# EAGLE design GBP USB-C Charging Kit (EAGLE 6.2)
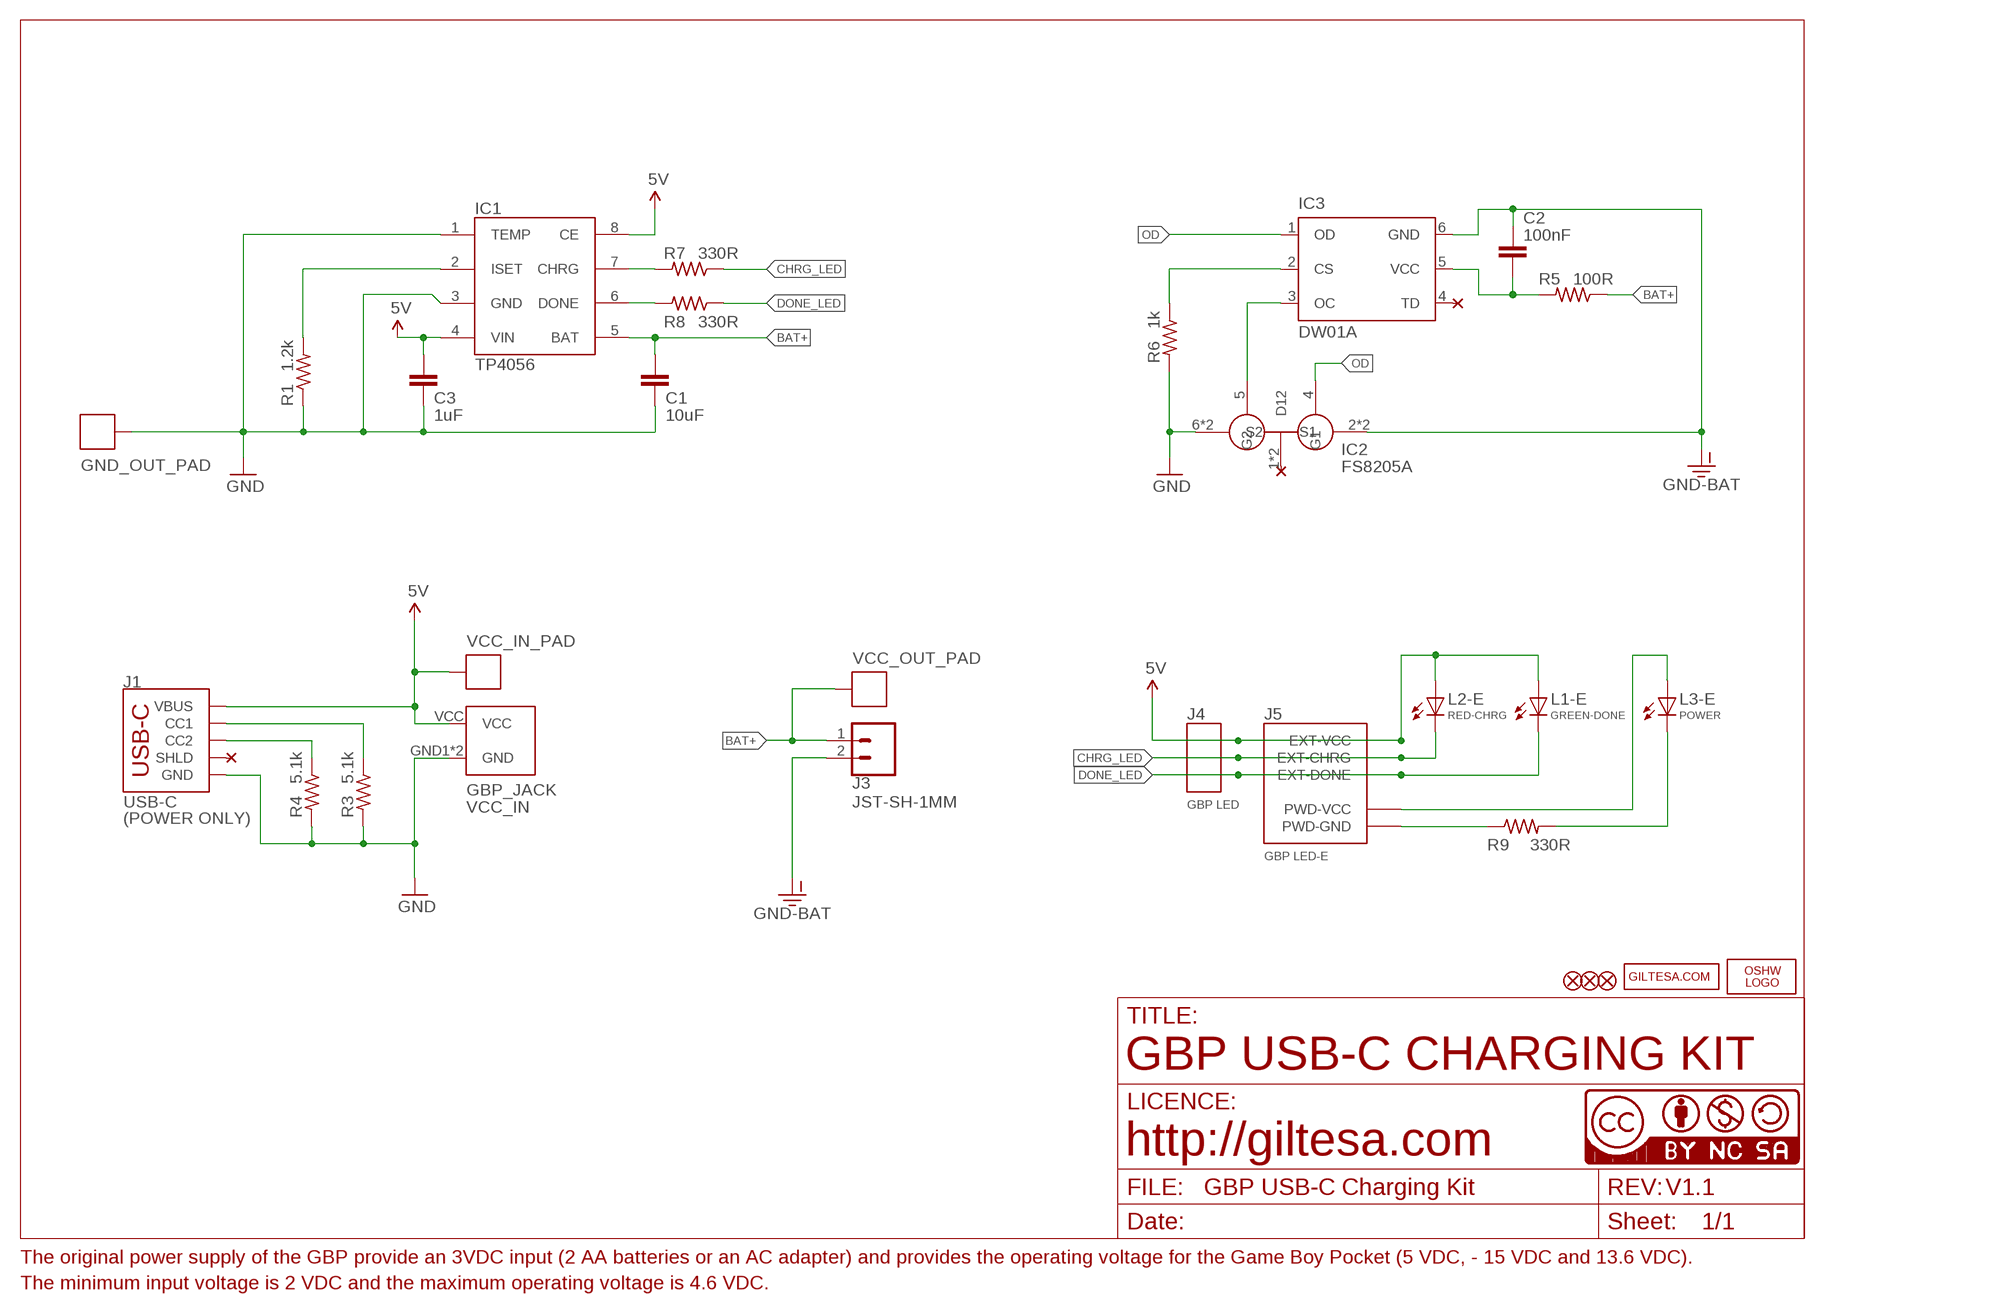
[diagram p0: schematic, sheet 1]

## Parts
C1  10uF  C0805  [C0805]
C2  100nF  C0603  [C0603]
C3  1uF  C0603  [C0603]
FD2  FIDUCIALUFIDUCIAL  [FIDUCIAL-MICRO]
FD3  FIDUCIALUFIDUCIAL  [FIDUCIAL-MICRO]
FD4  FIDUCIALUFIDUCIAL  [FIDUCIAL-MICRO]
GBP_JACK  VCC_IN  GBP_POWER_JACK  [GBP_POWER_JACK]
GND_OUT_PAD  1X01_SMT_1.8MM_2  [1X01_SMT_1.8MM_2]
IC1  TP4056  DIO5158  [SOIC-8]
IC2  8205A  FS8205A  [TSSOP8]
IC3  DW01A  DW01-P  [SOT23-6L]
J1  USB-C  USB-CPOWER  [USB-C_6P]
J3  JST-SH-1MM  JST-21MM  [JST-2-1MM-SMD_RIGHT]
J4  GBP LED  1X032  [1X03_SMD_2]
J5  GBP LED-E  GBP_LED  [GBP_LED]
L1-E  GREEN-DONE  L0402  [L0402]
L2-E  RED-CHRG  L0402  [L0402]
L3-E  POWER  L0402  [L0402]
LOGO1  OSHW_LOGO_FILLX0150-NT  [OSHW_FILLX150_NOTEXT]
R1  1.2k  R0402  [R0402]
R3  5.1k  R0402  [R0402]
R4  5.1k  R0402  [R0402]
R5  100R  R0402  [R0402]
R6  1k  R0402  [R0402]
R7  330R  R0402  [R0402]
R8  330R  R0402  [R0402]
R9  330R  R0402  [R0402]
U$6  CC-BY-NC-SA15MM  [CC-BY-NC-SA_15MM]
U$16  GILTESA.COM_MASK  [GILTESA.COM_MASK]
U$17  CC-NC-BCNIX  [CC-NC-B_NIX]
VCC_IN_PAD  1X01_SMT_1.8MM_3  [1X01_SMT_1.8MM_3]
VCC_OUT_PAD  1X01_SMT_1.8MM_3  [1X01_SMT_1.8MM_3]

## Nets
5V: C3.1 GBP_JACK.VCC IC1.4(VIN) IC1.8(CE) J1.VBUS1(VBUS) J1.VBUS2(VBUS) J4.3 J5.EXT-VCC L1-E.A L2-E.A VCC_IN_PAD.P$1
BAT+: C1.1 IC1.5(BAT) J3.1 R5.1 VCC_OUT_PAD.P$1
CHRG: IC1.7(CHRG) R7.2
CHRG_LED: J4.2 J5.EXT-CHRG L2-E.C R7.1
DONE: IC1.6(DONE) R8.2
DONE_LED: J4.1 J5.EXT-DONE L1-E.C R8.1
GND: C1.2 C3.2 GBP_JACK.GND1(GND) GBP_JACK.GND2(GND) GND_OUT_PAD.P$1 IC1.1(TEMP) IC1.3(GND) IC2.6(S2) IC2.7(S2) J1.GND1(GND) J1.GND2(GND) R1.1 R3.2 R4.2 R6.2
GND-BAT: C2.1 IC2.2(S1) IC2.3(S1) IC3.6(GND) J3.2
ISET: IC1.2(ISET) R1.2
N$1: IC3.2(CS) R6.1
N$2: IC2.5(G2) IC3.3(OC)
N$4: J1.A5(CC1) R3.1
N$6: J1.B5(CC2) R4.1
N$11: L3-E.C R9.2
OD: IC2.4(G1) IC3.1(OD)
PWD-GND: J5.PWD-GND J5.PWD-GND'(PWD-GND) R9.1
PWD-VCC: J5.PWD-VCC J5.PWD-VCC'(PWD-VCC) L3-E.A
VCC-DW: C2.2 IC3.5(VCC) R5.2
Unconnected: IC2.1(D12) IC2.8(D12) IC3.4(TD) J1.SHLD1(SHLD) J1.SHLD2(SHLD) J1.SHLD3(SHLD) J1.SHLD4(SHLD) J1.SHLD5(SHLD) J1.SHLD6(SHLD) J1.SHLD7(SHLD) J1.SHLD8(SHLD)

## Notes on the sheet
- IC2
- FS8205A
- (POWER ONLY)
- GBP USB-C CHARGING KIT
- http://giltesa.com
- V1.1
- The original power supply of the GBP provide an 3VDC input (2 AA batteries or an AC adapter) and provides the operating voltage for the Game Boy Pocket (5 VDC, - 15 VDC and 13.6 VDC).
- The minimum input voltage is 2 VDC and the maximum operating voltage is 4.6 VDC.

## Library data of the parts
C1 = ,giltesa:C0805
C2 C3 = ,giltesa:C0603
FD2-FD4 = SparkFun-Aesthetics:FIDUCIAL: Fiducial Alignment Points Point-of-reference for pick-and-place machines and other optical instruments.
GBP_JACK = ,giltesa:GBP_POWER_JACK
GND_OUT_PAD VCC_IN_PAD VCC_OUT_PAD = ,giltesa:1X01
IC1 = ERADIONICA:DIO5158
IC2 = SparkFun:FS8205A
IC3 = lipo:DW01-P: One Cell Lithium-ion/Polymer Battery Protection IC The DW01-P battery protection IC is designed to protect lithium-ion/polymer battery from damage or degrading the lifetime due to overcharge, overdischarge, and/or overcurrent for one-cell lithium-ion/polymer battery powered systems, such as cellular phones. The ultra-small package and less required external components make it ideal to integrate the DW01-P into the limited space of battery pack. The accurate ±50mV overcharging detection voltage ensures safe and full utilization charging. The very low standby current drains little current from the cell while in storage.
J1 = ,giltesa:USB-C
J3 = ,giltesa:JST-2
J4 = ,giltesa:1X03
J5 = ,giltesa:GBP_LED
L1-E L2-E L3-E = ,giltesa:L0402
LOGO1 = ohw-logo:OSHW_LOGO_FILL
R1 R3-R9 = ,giltesa:R0402
U$6 = ,giltesa_logos:CC-BY-NC-SA
U$16 = ,giltesa_logos:GILTESA.COM
U$17 = cc-by-nc-sa:CC-NC-BC: All hardware is licensed under the Creative Commons Attribution-Noncommercial-Share Alike 2.5 Switzerland License. To view a copy of this license, visit http://creativecommons.org/licenses/by-nc-sa/2.5/ch/ or send a letter to Creative Commons, 171 Second Street, Suite 300, San Francisco, California, 94105, USA.

## Net classes
1 power: width 0.61 mm, drill 0.406 mm, clearance 0.203 mm
2 gnd: width 0.305 mm, drill 0.406 mm, clearance 0.203 mm
3 power usb: width 0.508 mm, drill 0.406 mm, clearance 0.203 mm

## Board
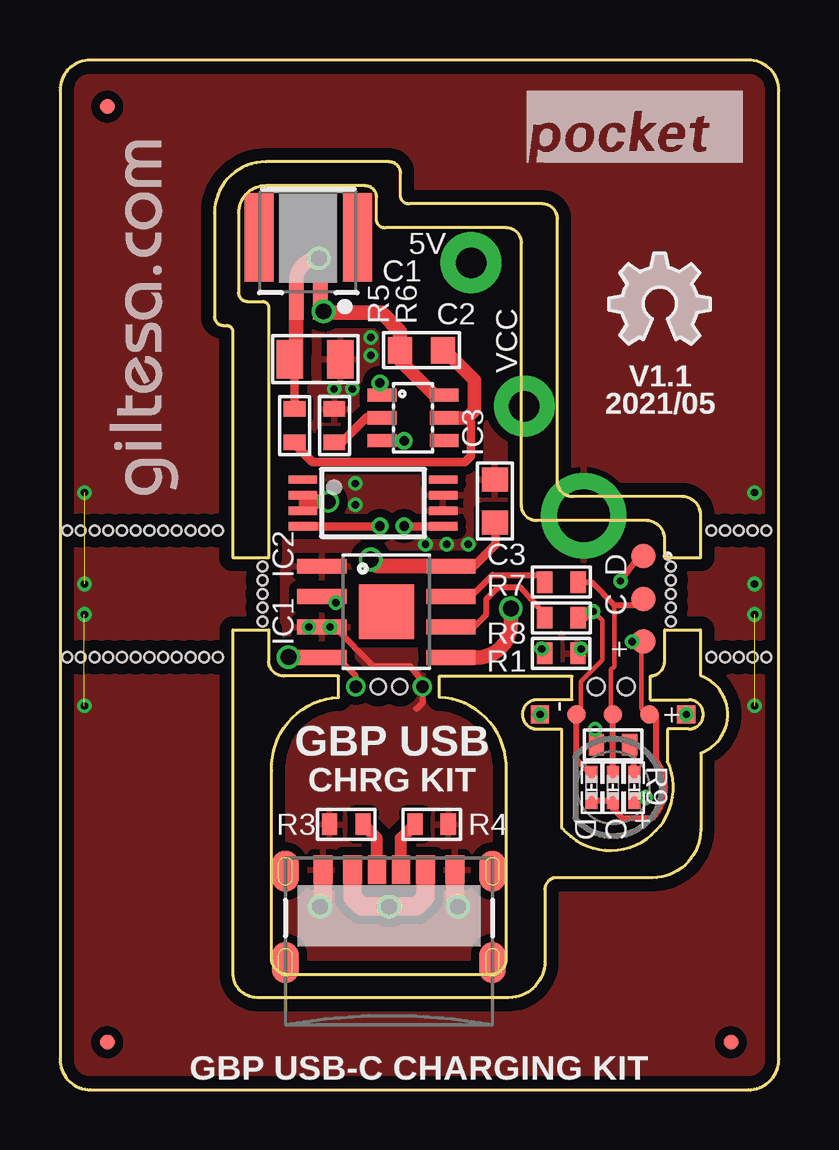
[diagram p1: board, top side]
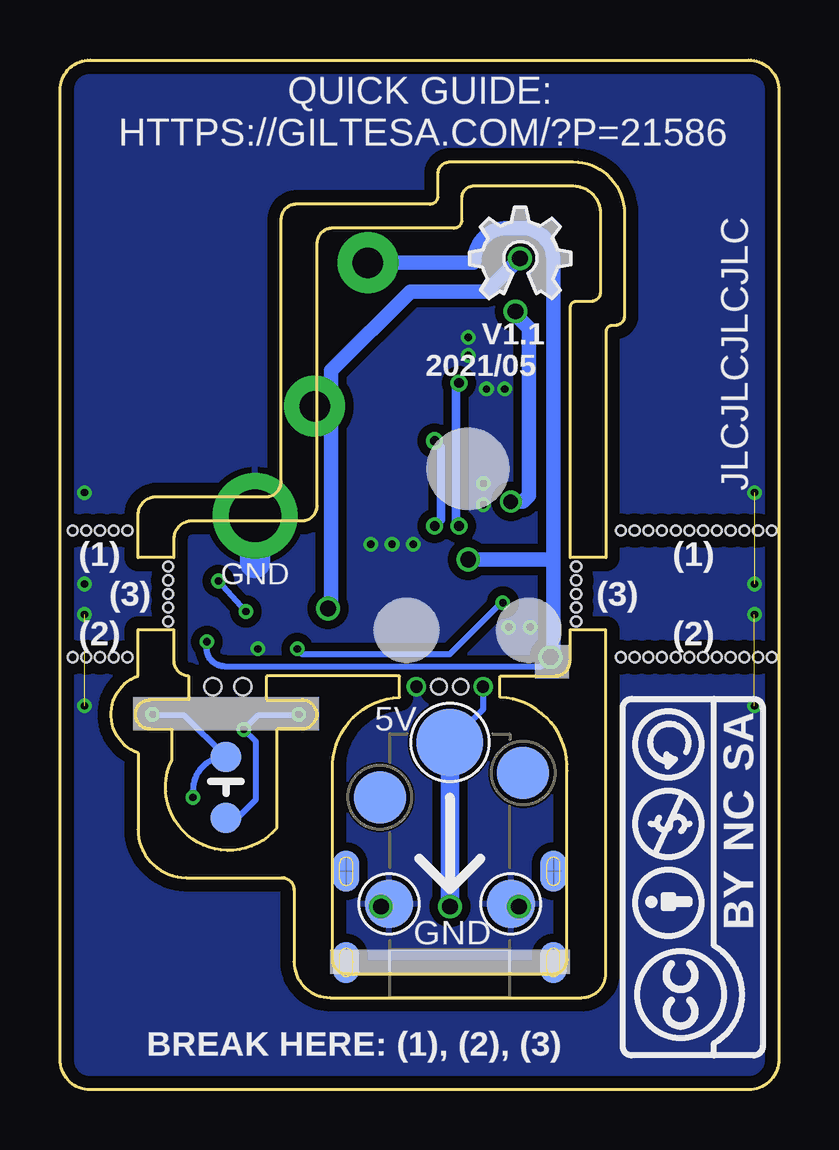
[diagram p2: board, bottom side, seen from below]

Size 29.97 x 42.93 mm. Coordinates in mm from the lower left corner, seen from the top.
Outline: 24.6,17.25 24.6,16.26 26.21,16.26 arc-180 26.21,15.04 25.32,15.04 25.32,13.71 arc-165 20.92,10.92 20.92,15.04 19.89,15.04 arc-180 19.89,16.26 21.35,16.26 21.35,17.25 15.81,17.25 15.81,16.36 arc-90 18.61,13.31 18.61,5.45 arc-90 17.97,4.82 9.46,4.82 arc-90 8.83,5.45 8.83,13.31 arc-90 11.62,16.36 11.62,17.25 9.34,17.25 arc-90 8.7,17.88 8.7,19.17 7.22,19.17 7.22,4.84 arc90 8.22,3.84 18.72,3.84 arc90 20.22,5.34 20.22,8.34 arc-90 20.72,8.84 24.72,8.84 arc90 26.72,10.84 26.72,14.04 arc140 26.72,17.26 26.71,19.17 25.21,19.17 25.21,17.88 arc-90 24.6,17.25
Outline: 25.21,22.18 25.21,22.96 arc90 24.45,23.72 19.88,23.72 arc-90 19.24,24.36 19.24,35.29 arc90 18.61,35.93 13.59,35.93 arc-90 13.21,36.21 13.21,37.21 arc90 12.7,37.68 8.57,37.68 arc90 7.44,36.54 7.44,33.24 arc90 7.82,32.86 8.45,32.86 arc-90 8.7,32.61 8.7,22.18 7.2,22.18 7.2,31.61 arc90 6.95,31.86 6.82,31.86 arc-90 6.44,32.24 6.44,36.54 arc-90 8.57,38.68 13.7,38.68 arc-90 14.21,38.21 14.21,37.21 arc90 14.59,36.93 20.11,36.93 arc-90 20.74,36.29 20.74,25.36 arc90 21.38,24.72 25.95,24.72 arc-90 26.71,23.96 26.71,22.18 25.21,22.18
Outline: 1.27,0 28.7,0 arc90 29.97,1.27 29.97,41.66 arc90 28.7,42.93 1.27,42.93 arc90 0,41.66 0,1.27 arc90 1.27,0
Copper layers (1*16): Top 0.035mm / dielectric 1.6mm / Bottom 0.035mm
Design rules: minimum track width 6mil, minimum drill 12mil, track to track 6mil, track to pad 6mil, pad to pad 6mil, via to via 8mil, smd to smd 0mil, copper to edge 20mil, drill to drill 10mil, minimum pad ring 6mil, minimum via ring 6mil, stop-mask expansion 0mil, vias tented up to drill 100mil, thermal gap 10mil
Holes 0.64 mm at 13.27,16.8 14.17,16.8
Holes 0.71 mm at 22.35,16.8 23.6,16.8
Holes 0.41 mm at 25.47,21.24 25.47,20.1 25.47,20.67 8.45,21.24 8.45,20.1 8.45,20.67 27.16,23.31 28.3,23.31 27.73,23.31 28.87,23.31 29.45,23.31 27.16,18.03 28.3,18.03 27.73,18.03 28.87,18.03 29.45,18.03 4.3,23.31 5.44,23.31 4.87,23.31 6.01,23.31 6.59,23.31 4.3,18.03 5.44,18.03 4.87,18.03 6.01,18.03 6.59,18.03 3.73,18.03 3.16,18.03 2.59,18.03 2.01,18.03 1.44,18.03 0.87,18.03 0.3,18.03 3.73,23.31 3.16,23.31 2.59,23.31 2.01,23.31 1.44,23.31 0.87,23.31 0.3,23.31 8.45,21.81 8.45,19.53 25.47,21.81 25.47,19.53
tRestrict: area 8.4,19.2 to 8.8,22.1
bRestrict: area 25,19.2 to 25.4,22.1

### Footprints (pad centres in the part's own frame; a part is rotated, then mirrored left to right if it is on the bottom)
C0805 = smd 1.1 x 1.6: 1 -1.05,0; 2 1.05,0
C0603 = smd 1 x 1.1: 1 -0.901,0; 2 0.901,0
FIDUCIAL-MICRO = smd 0.635 x 0.635: 1 0,0
GBP_POWER_JACK = smd 2.032 x 2.032 bottom: GND1 -2.54,1.905; GND2 2.54,1.905 | smd 2.2 x 2.2 bottom: NC1 -3.048,7.366; NC2 2.921,6.35 | smd 2.8 x 2.8 bottom: VCC 0,8.636
1X01_SMT_1.8MM_2 = drill 2.184 pad 3.556: P$1 0,0
SOIC-8 = smd 0.61 x 2.057: 1 -2.07,-2.892; 2 -0.8,-2.892; 3 0.47,-2.892; 4 1.74,-2.892; 5 1.74,2.492; 6 0.47,2.492; 7 -0.8,2.492; 8 -2.07,2.492 | smd 2.286 x 2.286: EPAD -0.165,-0.2
TSSOP8 = smd 1.2 x 0.35: 1 -2.925,0.975; 2 -2.925,0.325; 3 -2.925,-0.325; 4 -2.925,-0.975; 5 2.925,-0.975; 6 2.925,-0.325; 7 2.925,0.325; 8 2.925,0.975
SOT23-6L = smd 0.55 x 1.2: 1 -0.95,-1.3; 2 0,-1.3; 3 0.95,-1.3; 4 0.95,1.3; 5 0,1.3; 6 -0.95,1.3
USB-C_6P = smd 0.76 x 1.2: A5 -0.5,-0.08; B5 0.5,-0.08 | smd 0.8 x 1.2: GND1 -2.75,-0.08; GND2 2.75,-0.08; VBUS1 -1.52,-0.08; VBUS2 1.52,-0.08 | smd 1.1 x 1.7: SHLD1 -4.32,-0.15; SHLD2 4.32,-0.15; SHLD5 -4.32,-3.95; SHLD8 4.32,-3.95 | smd 1.1 x 1.7 bottom: SHLD3 -4.32,-0.15; SHLD4 4.32,-0.15; SHLD6 -4.32,-3.95; SHLD7 4.32,-3.95
JST-2-1MM-SMD_RIGHT = smd 0.6 x 1.524: 1 -0.5,-2.017; 2 0.5,-2.017 | smd 1.219 x 3.683: NC1 -2.054,0.635; NC2 2.054,0.635
1X03_SMD_2 = smd 1.016 x 1.016: 1 0,-1.778; 2 0,0; 3 0,1.778
GBP_LED = smd 0.762 x 0.762: EXT-CHRG -3.048,0; EXT-DONE -3.048,-1.524; EXT-VCC -3.048,1.524; PWD-GND' -3.048,-3.048; PWD-VCC' -3.048,3.048 | smd 1.27 x 1.27 bottom: PWD-GND 1.27,0; PWD-VCC -1.27,0
L0402 = smd 0.7 x 0.5: A -0.55,0; C 0.55,0
R0402 = smd 0.635 x 0.9: 1 -0.694,0; 2 0.694,0
1X01_SMT_1.8MM_3 = drill 1.27 pad 2.54: P$1 0,0

### Placement (x,y rotation side)
C1  10.64,30.45 0 top
C2  15.07,30.82 0 top
C3  18.13,24.54 90 top
FD2  27.97,1.99 0 top
FD3  1.97,1.99 0 top
FD4  1.97,40.99 0 top
GBP_JACK  13.72,5.84 0 top
GND_OUT_PAD  21.84,23.93 0 top
IC1  13.81,19.76 270 top
IC2  13.05,24.46 0 top
IC3  14.72,28.01 270 top
J1  13.72,9.25 0 top
J3  10.35,34.89 0 top
J4  24.32,20.46 180 top
J5  23.05,12.6 270 top
L1-E  22.17,12.6 90 top
L2-E  23.05,12.6 90 top
L3-E  23.94,12.6 90 top
LOGO1  12.91,32.98 0 bottom
LOGO2  OSHW_LOGO_FILLX0150-NT  [OSHW_FILLX150_NOTEXT]  22.88,31.07 0 top
R1  20.9,18.19 180 top
R3  11.94,11.06 180 top
R4  15.49,11.06 0 top
R5  9.78,27.69 270 top
R6  11.44,27.69 90 top
R7  20.9,21.16 180 top
R8  20.9,19.67 180 top
R9  23.05,14.38 0 top
U$2  [GAME_BOY_POCKET]  19.47,38.59 0 top
U$6  0.54,1.3 90 bottom
U$16  5,24.71 90 top
U$17  13.72,5.84 0 top
VCC_IN_PAD  17.14,34.47 0 top
VCC_OUT_PAD  19.36,28.49 0 top

### Tracks (layer width: path | path; a pad name or v marks a point on that pad's centre or on a via)
5V  (via drill 0.3, 0.51, 0.66)
  Top 0.178: J5.EXT-VCC arc-91 24.23,15.99 24.23,18.6 arc-90 J4.3
  Top 0.254: 22.15,12.06 22.23,12.06 | 22.23,12.06 23.04,12.06 | 23.04,12.06 23.04,11.75 23.45,11.34 24.72,11.34 arc80 24.85,13.75 24.85,15.66 24.59,15.66 J5.EXT-VCC | L1-E.A 22.22,12.05 22.23,12.06 | L2-E.A 23.04,12.06 | IC1.4 11.7,18.02 11.7,17.89 12.32,17.27 12.32,16.81 v12.33,16.8 | J4.3 arc90 J4.3 arc-90 J4.3 | v23.85,18.68 J4.3
  Top 0.356: IC1.8 17.26,21.83 18.16,22.73 18.16,23.61 C3.1
  Top 0.61: v9.52,18.03 10.9,18.03 IC1.4 | IC1.8 13.22,21.83 v12.95,22.1
  Top 0.762: J1.VBUS1 12.2,8.01 12.57,7.64 v13.72,7.64 14.86,7.64 15.24,8.01 J1.VBUS2
  Bottom 0.254: v9.52,18.03 9.91,17.65 23.11,17.65 arc90 23.85,18.39 v23.85,18.68 | GBP_JACK.VCC 12.33,15.86 v12.33,16.8
  Bottom 0.61: 9.4,22.1 9.4,18.16 arc90 v9.52,18.03 | v12.95,22.1 9.4,22.1 | 9.4,22.1 9.4,34.66 arc-90 10.79,35.92 11.32,35.92 arc-90 12.7,34.54 arc90 12.77,34.47 VCC_IN_PAD.P$1
  Bottom 0.762: v13.72,7.64 GBP_JACK.VCC
BAT+  (via drill 0.66)
  Top 0.356: R5.1 9.78,30.26 C1.1
  Top 0.61: v18.8,20.07 18.8,19.43 arc-90 17.38,18.02 IC1.5 | v10.79,34.66 arc90 9.85,33.71 J3.1 9.85,30.72 C1.1
  Bottom 0.61: VCC_OUT_PAD.P$1 18.75,28.49 18.67,28.57 | 18.67,28.57 18.67,20.19 arc90 v18.8,20.07 | v10.79,34.66 10.81,34.66 12.19,33.27 15.37,33.27 18.67,29.97 18.67,28.57
CHRG
  Top 0.254: R7.2 20.14,21.16 20.07,21.08 | IC1.7 17.13,20.56 18.03,21.46 19.91,21.46 R7.2 | 20.03,21.34 R7.2
CHRG_LED
  Top 0.178: J5.EXT-CHRG 23.05,15.74 22.98,15.82 22.98,17.51 23.11,17.65 23.11,20.19
  Top 0.254: L2-E.C 23.04,13.16 23.04,15.66 J5.EXT-CHRG | J4.2 24.32,20.38 24.13,20.19 23.11,20.19 22.15,21.16 R7.1
DONE
  Top 0.254: IC1.6 17.26,19.29 17.78,19.81 17.78,20.45 18.29,20.95 19.18,20.95 20.21,19.79 R8.2
DONE_LED  (via drill 0.3)
  Top 0.178: 21.51,15.66 21.51,15.85 21.48,15.88 21.72,15.86 21.72,17.02 22.61,17.91 22.61,19.56 v22.23,19.94
  Top 0.254: L1-E.C 21.51,13.79 21.51,15.66 21.52,15.65 J5.EXT-DONE | J4.1 24.13,22.22 v23.37,21.21 | R8.1 21.96,19.67 v22.23,19.94
  Bottom 0.254: v22.23,19.94 v23.37,21.21
GND  (via drill 0.3, 0.51, 0.66)  (3 unrouted)
  Top 0.254: 14.86,15.88 15.11,16.13 v15.11,16.8 15.11,17.02 14.6,17.65 13.08,17.65 11.45,19.29 | R1.1 21.6,18.25 v21.73,18.38
  Top 0.762: J1.GND1 10.97,8.02 v10.84,7.64 | J1.GND2 16.47,8.02 v16.59,7.64
  Bottom 0.762: GBP_JACK.GND2 16.45,7.94 16.45,7.75 v16.59,7.64 | GBP_JACK.GND1 11.12,7.81 11.12,7.61 v10.84,7.64
  Bottom 1.27: GND_OUT_PAD.P$1 21.84,21.96
  other vias: 10.37,19.29 11.26,19.29 17.02,22.73 16.13,22.73 15.24,22.73 12.32,25.27 12.32,24.38 12.95,31.37 12.95,30.61 11.43,29.21 12.19,29.21 28.96,19.81 28.96,21.08 1.02,21.08 1.02,19.81 1.02,16 1.02,24.89 28.96,24.89 28.96,16
  pour Top (isolate 0.356): -0.51,43.43 30.48,43.43 30.48,-0.46 -0.51,-0.46
  pour Bottom (isolate 0.356): -0.51,43.43 30.48,43.43 30.48,-0.46 -0.51,-0.46
GND-BAT  (via drill 0.61, 0.66)
  Top 0.356: 10.54,24.51 10.4,24.51 IC2.2 IC2.3
  Top 0.559: IC3.6 15.62,28.96 14.22,30.35 14.22,30.77 C2.1
  Top 0.61: J3.2 10.85,32.45 v10.98,32.45 11.05,32.38 13.4,32.38 14.17,31.61 C2.1 | v11.18,24.51 10.54,24.51
  Bottom 0.61: v10.98,32.45 10.92,32.26 10.41,31.75 10.41,24.76 10.67,24.51 v11.18,24.51
ISET  (via drill 0.3)
  Top 0.254: IC1.2 11.25,20.56 v11.51,20.31 | R1.2 20.01,18.2 v20.08,18.38
  Bottom 0.254: v11.51,20.31 11.57,20.31 13.72,18.16 19.86,18.16 v20.08,18.38
N$1
  Top 0.356: R6.1 11.75,26.99 12.83,28.07 13.21,28.07 13.27,28.01 IC3.2
N$2  (via drill 0.41)
  Top 0.356: IC2.5 v14.36,23.49 v14.35,23.49 | v14.35,27.05 13.43,27.05 IC3.3
  Bottom 0.356: v14.35,23.49 14.1,23.75 14.1,26.8 v14.35,27.05
N$4
  Top 0.508: J1.A5 13.22,10.48 R3.1
N$6
  Top 0.508: J1.B5 14.22,10.48 R4.1
N$11
  Top 0.254: 23.75,14.37 23.93,14.19 23.93,13.16 23.93,13.15 L3-E.C | 23.75,14.37 23.73,14.38 | R9.2 23.75,14.37
OD  (via drill 0.41)
  Top 0.356: IC2.4 v13.33,23.49 | v13.33,29.46 13.33,29.05 IC3.1
  Bottom 0.356: v13.33,23.49 13.33,23.62 13.46,23.75 13.46,29.34 v13.33,29.46
PWD-GND  (via drill 0.3)
  Top 0.254: v22.31,15.02 22.31,14.42 R9.1 | J5.PWD-GND' 20.04,15.65 v20.02,15.65
  Bottom 0.254: J5.PWD-GND 22.56,11.34 21.8,12.1 21.8,14.51 v22.31,15.02 21.71,15.62 20.04,15.62 v20.02,15.65
PWD-VCC  (via drill 0.3)
  Top 0.254: v24.42,12.18 24.05,12.18 arc90 23.93,12.06 23.93,12.05 L3-E.A | J5.PWD-VCC' 26.19,15.65 J5.PWD-VCC'
  Bottom 0.254: v24.42,12.18 24.42,12.49 arc90 23.04,13.88 J5.PWD-VCC 24.81,15.62 26.09,15.62 J5.PWD-VCC'
  other vias: 26.11,15.65
VCC-DW
  Top 0.356: R5.2 9.78,26.92 10.54,26.16 16.89,26.16 17.14,26.42 17.14,27.82 16.96,28.01
  Top 0.559: C2.2 16.04,30.82 17.27,29.59 17.27,28.32 16.96,28.01 IC3.5

### Text on the board
tPlace: 5V | VCC | V1.1 | 2021/05 | D | C | + | - | + | GBP USB | CHRG KIT | + | D | C | GBP USB-C CHARGING KIT
bPlace: QUICK GUIDE: | HTTPS://GILTESA.COM/?P=21586 | V1.1 | JLCJLCJLCJLC | 2021/05 | (1) | GND | (1) | (3) | (3) | (2) | (2) | 5V | GND | BREAK HERE: (1), (2), (3)